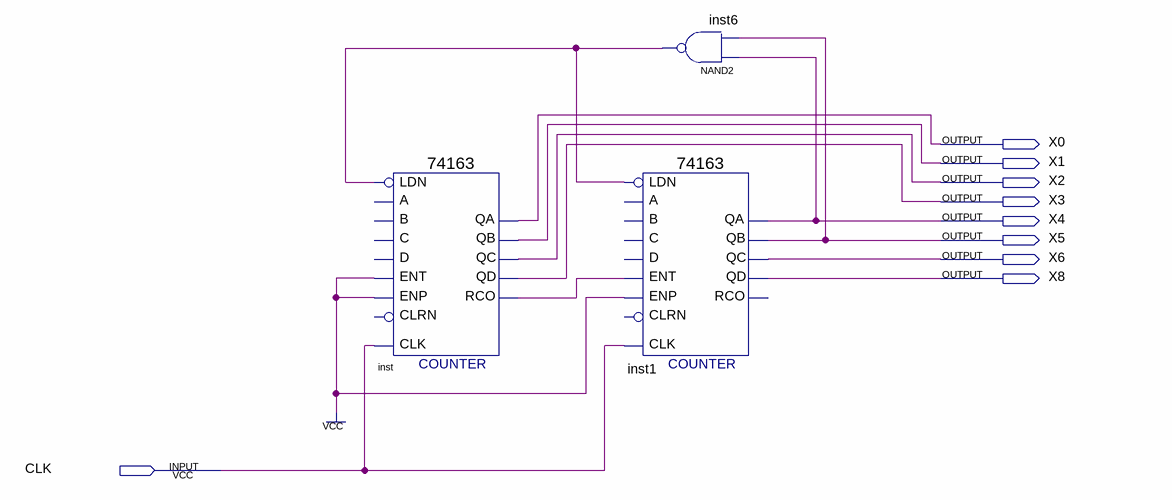
[diagram p0: schematic sheet]
// Quartus schematic Mod64Counter.bdf as structural Verilog: 3 symbols, 9 pins
module Mod64Counter (
  input  CLK,
  output X0,
  output X1,
  output X2,
  output X3,
  output X4,
  output X5,
  output X6,
  output X8
);

  wire inst6_out, inst_rco;

  \74163  inst (
    .ENT(1'b1), .CLK(CLK), .ENP(1'b1), .LDN(inst6_out), .QA(X0), .QB(X1), .QC(X2), .QD(X3), .RCO(inst_rco));  // open: C, B, A, D, CLRN
  \74163  inst1 (
    .ENT(inst_rco), .CLK(CLK), .ENP(1'b1), .LDN(inst6_out), .QA(X4), .QB(X5), .QC(X6), .QD(X8));  // open: C, B, A, D, CLRN, RCO
  nand inst6 (inst6_out, X4, X5);
endmodule
